# EasyEDA Pro project ProPrj_super_cap_ctrl_v1.0_2025-02-24.epro, board 功率板PCB
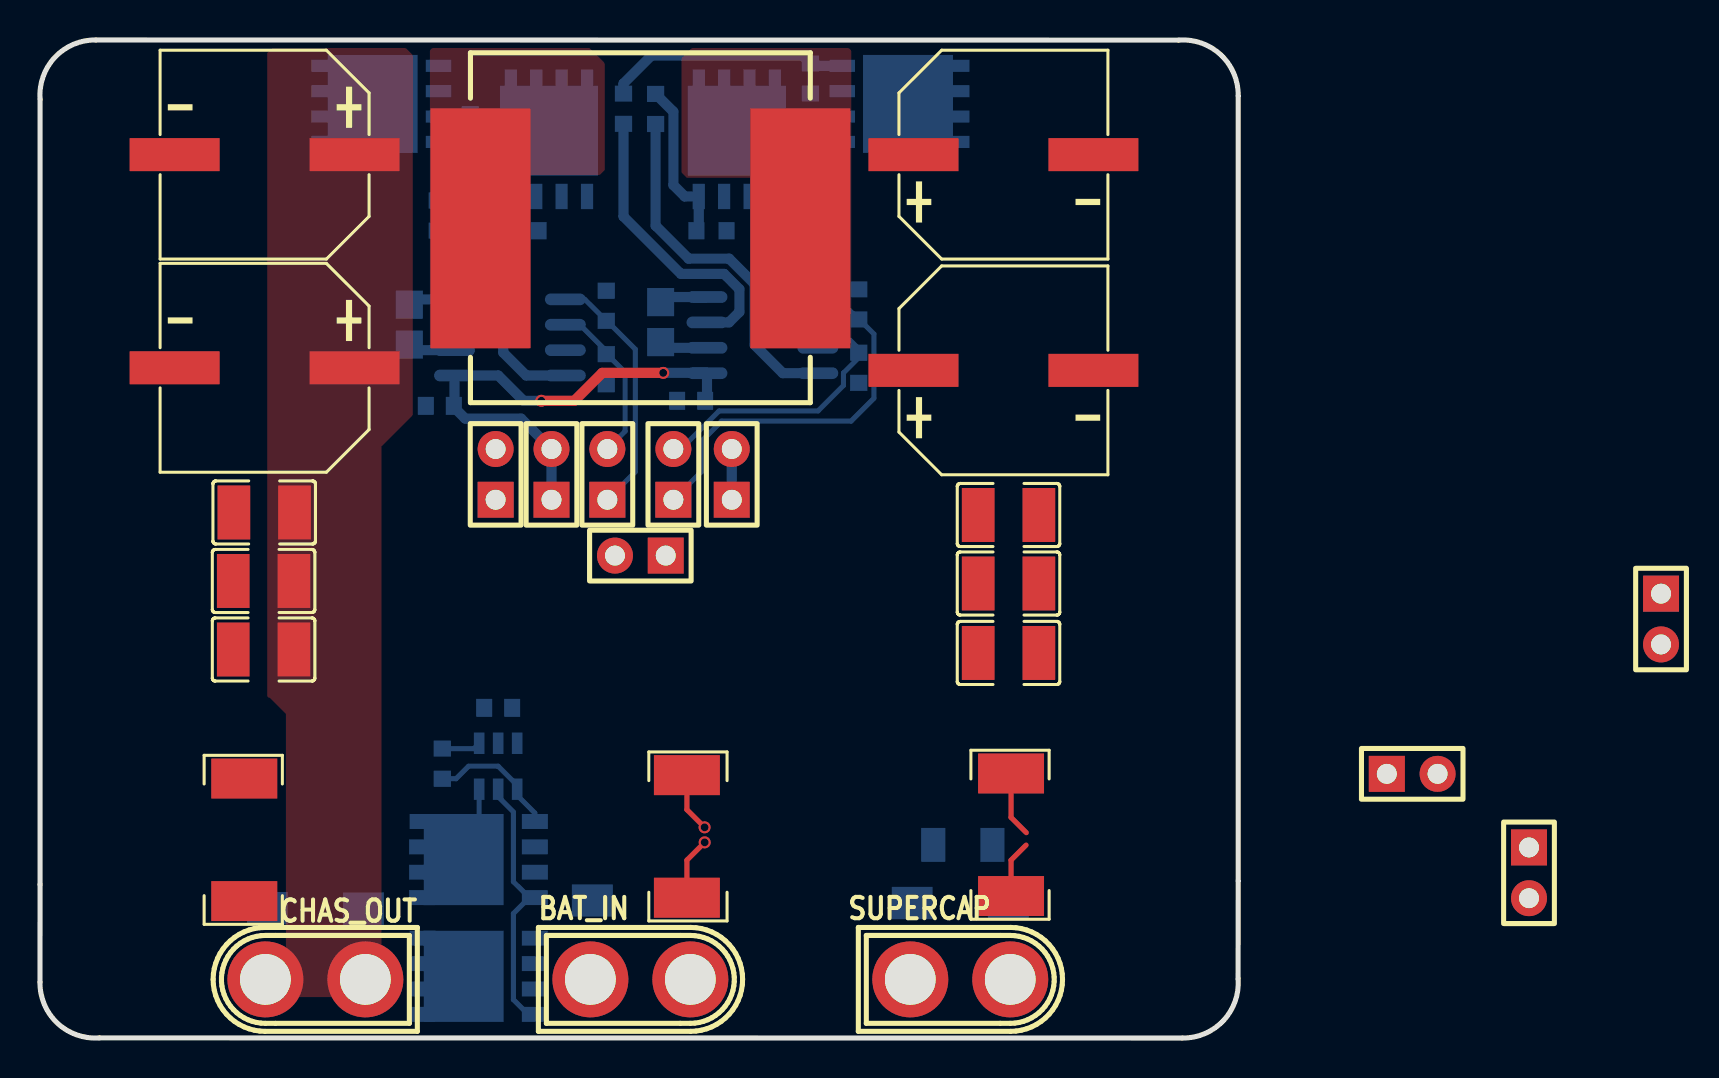
[diagram p10: board, top side]
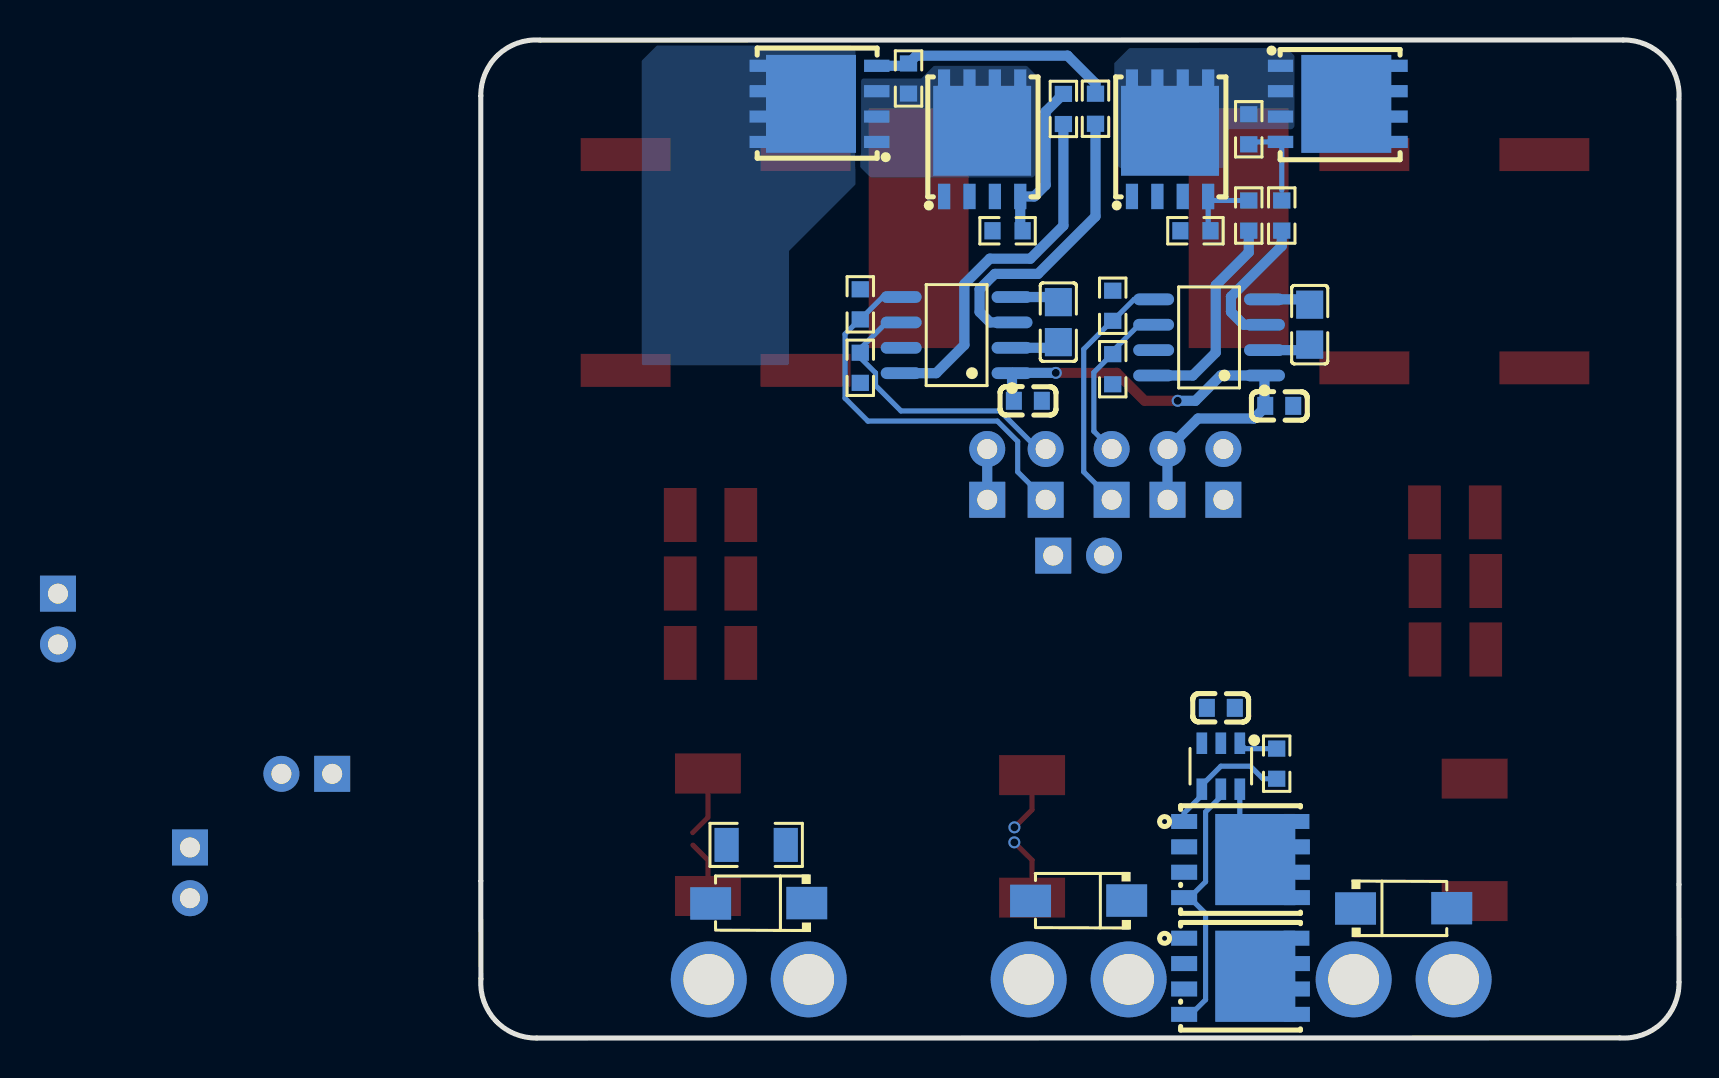
[diagram p11: board, bottom side, seen from below]

Outline 59.94 x 49.95 mm; copper layers: Top Layer, Bottom Layer. Coordinates in mm from the lower left corner of the outline.
Outline path: 0,7.68 0,2.79 arc(0.87,0.75) 2.96,0.01 57.14,0 arc(59.19,0.87) 59.93,2.96 59.94,7.87 59.94,47.15 arc(59.07,49.2) 56.97,49.94 2.79,49.95 arc(0.75,49.08) 0.01,46.98 0,7.68
Stack: Top Layer 0.035mm / Dielectric1 1.51mm FR4 er 4.5 / Bottom Layer 0.035mm

## Design rules (mm)
net HO_1: DP2
net LO_1: DP2
net GND: DP1
net HO_2: DP3
net LO_2: DP3
net VCHASSIS-: DP1
template: 自定义配置
spacing copperThickness1oz (default): track to track 0.102, other pairs 0.076 to 0.3
spacing copperThickness2oz: track to track 0.203, other pairs 0.152 to 0.3
track width copperThickness1oz (default): min 0.127, default 0.254, max 2.54
track width copperThickness2oz: min 0.203, default 0.254, max 2.54
differential pair differentialPair (default): width min 0.127, default 0.254, max 2.54; gap min 0.152, default 0.152
via viaSize (default): diameter min 0.399, default 0.599, max 10; hole min 0.249, default 0.399, max 6.299

## Placement (name value [footprint] x y rotation side)
C1  10uF  [C0603]  20 31.64 0 bottom
C2  1uF  [C0805]  18.47 35.7 270 bottom
C3  150uF  [CAP-SMD_BD10.0-L10.3-W10.3-LS11.3-FD]  11.23 33.54 180 top
C4  150uF  [CAP-SMD_BD10.0-L10.3-W10.3-LS11.3-FD]  11.23 44.21 180 top
C7  47uF  [C1210]  11.21 26.3 0 top
C8  47uF  [C1210]  11.18 22.87 0 top
C9  47uF  [C1210]  11.18 19.44 0 top
C10  150uF  [CAP-SMD_BD10.0-L10.3-W10.3-LS11.3-FD]  48.19 44.21 0 top
C11  150uF  [CAP-SMD_BD10.0-L10.3-W10.3-LS11.3-FD]  48.19 33.41 0 top
C12  47uF  [C1210]  48.45 26.18 180 top
C13  47uF  [C1210]  48.45 22.75 180 top
C14  47uF  [C1210]  48.45 19.27 180 top
C15  10uF  [C0603]  32.57 31.89 0 bottom
C16  1uF  [C0805]  31.05 35.83 270 bottom
C195  100nF  [C0603]  22.92 16.52 180 bottom
CN5  XT30U-M  [CONN-TH_XT30U-M]  13.77 2.93 180 top
CN6  XT30U-M  [CONN-TH_XT30U-M]  30.03 2.93 0 top
CN7  XT30U-M  [CONN-TH_XT30U-M]  46.03 2.93 0 top
D4  SMAJ75A  [SMA_L4.3-W2.6-LS5.0-RD]  46.03 6.74 0 bottom
D5  SMAJ75A  [SMA_L4.3-W2.6-LS5.0-RD]  13.77 6.49 180 bottom
D6  SMAJ75A  [SMA_L4.3-W2.6-LS5.0-RD]  30.03 6.87 0 bottom
H7  -  [HDR-TH_2P-P2.54-V-M-1]  28.38 28.21 90 top
H8  -  [HDR-TH_2P-P2.54-V-M-1]  31.68 28.21 90 top
H9  -  [HDR-TH_2P-P2.54-V-M-1]  34.6 28.21 90 top
H10  -  [HDR-TH_2P-P2.54-V-M-1]  22.79 28.21 90 top
H11  -  [HDR-TH_2P-P2.54-V-M-1]  25.59 28.21 90 top
H12  -  [HDR-TH_2P-P2.54-V-M-1]  30.03 24.14 180 top
H13  -  [HDR-TH_2P-P2.54-V-M-1]  81.08 20.97 270 top
H14  -  [HDR-TH_2P-P2.54-V-M-1]  68.64 13.22 0 top
H15  -  [HDR-TH_2P-P2.54-V-M-1]  74.48 8.27 270 top
L1  22uH  [IND-SMD_L17.5-W17.0_YXMAC1770]  30.03 40.53 0 top
Q7  BSC030N08NS5  [PG-TDSON-8_L5.0-W6.0-P1.27-BL-EP]  21.93 3.09 270 bottom
Q8  BSC030N08NS5  [PG-TDSON-8_L5.0-W6.0-P1.27-BL-EP]  21.93 8.93 270 bottom
Q11  BSC070N10NS5-HXY  [PDFN-8_L6.0-W5.0-P1.27-BL-A]  17.08 46.75 270 bottom
Q12  BSC070N10NS5-HXY  [PDFN-8_L6.0-W5.0-P1.27-BL-A]  42.98 46.75 90 bottom
Q13  BSC070N10NS5-HXY  [PDFN-8_L6.0-W5.0-P1.27-BL-A]  25.46 44.97 180 bottom
Q14  BSC070N10NS5-HXY  [PDFN-8_L6.0-W5.0-P1.27-BL-A]  34.86 44.97 180 bottom
R1  10K  [R0603]  21.52 45.48 270 bottom
R2  4.7R  [R0603]  19.87 41.16 270 bottom
R3  10K  [R0603]  24.19 40.4 180 bottom
R4  4.7R  [R0603]  21.52 41.16 270 bottom
R5  10K  [R0603]  38.54 48.02 90 bottom
R6  4.7R  [R0603]  29.19 46.51 270 bottom
R7  10K  [R0603]  33.59 40.4 180 bottom
R8  4.7R  [R0603]  30.79 46.5 270 bottom
R9  10K  [R0603]  28.33 33.47 90 bottom
R10  10K  [R0603]  28.33 36.65 270 bottom
R11  10K  [R0603]  40.95 33.54 90 bottom
R12  10K  [R0603]  40.95 36.72 270 bottom
R151  10mΩ  [RES-SMD_L6.4-W3.2-R2512]  48.57 10.17 90 top
R152  20K  [R1206]  46.16 9.67 180 bottom
R153  10mΩ  [RES-SMD_L6.4-W3.2-R2512]  10.22 9.92 90 top
R154  47R  [R0603]  20.12 13.73 270 bottom
R155  10mΩ  [RES-SMD_L6.4-W3.2-R2512]  32.36 10.09 270 top
U2  UCC27211D  [SOIC-8_L4.9-W3.9-P1.27-LS6.0-BL]  23.51 35.06 90 bottom
U3  UCC27211D  [SOIC-8_L4.9-W3.9-P1.27-LS6.0-BL]  36.14 35.18 90 bottom
U30  LM5050Q0MK-1/NOPB  [SOT-23-6_L2.9-W1.6-P0.95-LS2.8-BL]  22.92 13.6 0 bottom

## Footprints (pads in the part's own frame, mm; a bottom-side part is the same pattern mirrored in y, then rotated)
C0603
  rect 0.8x0.9 smd: 1(-0.7,0) 2(0.7,0)
C0805
  rect 1.41x1.35 smd: 1(-1,0) 2(1,0)
C1210
  rect 1.635x2.7 smd: 1(-1.518,0) 2(1.518,0)
CAP-SMD_BD10.0-L10.3-W10.3-LS11.3-FD
  rect 4.5x1.65 smd: 1(-4.5,0) 2(4.5,0)
CONN-TH_XT30U-M
  round 3.8 hole 2.54: 1(-2.5,0) 2(2.5,0)
HDR-TH_2P-P2.54-V-M-1
  rect 1.8x1.8 hole 1: 1(-1.27,0)
  round 1.8 hole 1: 2(1.27,0)
IND-SMD_L17.5-W17.0_YXMAC1770
  rect 5x12 smd: 1(-8,0) 2(8,0)
PDFN-8_L6.0-W5.0-P1.27-BL-A
  rect 0.61x1.27 smd: 1(-1.905,-2.856) 2(-0.635,-2.856) 3(0.635,-2.856) 4(1.905,-2.856)
  rect 0.61x1.3 smd: 5(1.905,2.856) 6(0.635,2.856) 7(-0.635,2.856) 8(-1.905,2.856)
  rect 4.9x4.5 smd: 8(0,0.433)
PG-TDSON-8_L5.0-W6.0-P1.27-BL-EP
  rect 0.75x1.3 smd: 1(-1.905,-2.82) 2(-0.635,-2.82) 3(0.635,-2.82) 4(1.905,-2.82) 5(1.905,2.82) 6(0.635,2.82) 7(-0.635,2.82) 8(-1.905,2.794)
  rect 4.56x4 smd: 8(0,0.737)
R0603
  rect 0.806x0.864 smd: 1(-0.753,0) 2(0.753,0)
R1206
  rect 1.208x1.701 smd: 1(-1.479,0) 2(1.479,0)
RES-SMD_L6.4-W3.2-R2512
  rect 2x3.3 smd: 1(-3.067,0) 2(3.067,0)
SMA_L4.3-W2.6-LS5.0-RD
  rect 2.046x1.62 smd: 1(-2.404,-0.009) 2(2.404,0.009)
SOIC-8_L4.9-W3.9-P1.27-LS6.0-BL
  oval 0.588x2.045 smd: 1(-1.905,-2.772) 2(-0.635,-2.772) 3(0.635,-2.772) 4(1.905,-2.772) 5(1.905,2.772) 6(0.635,2.772) 7(-0.635,2.772) 8(-1.905,2.772)
SOT-23-6_L2.9-W1.6-P0.95-LS2.8-BL
  rect 0.532x1.072 smd: 1(-0.95,-1.149) 2(0,-1.149) 3(0.95,-1.149) 4(0.95,1.149) 5(0,1.149) 6(-0.95,1.149)

## Nets
As in the schematic.

## Via types
v1: diameter 0.6, hole 0.399, Top Layer to Bottom Layer, 4 vias

## Routing (per net, layer and track width the routed paths; a pad name or vN(x,y) marks a point on that pad's centre or on a via; arc(x,y) is an arc through that point)
GND: length 6.1
  Top Layer w0.254: v1(33.24,10.54) 32.36,11.43 R155.1 ; 48.57,13.11 48.57,11.04 49.33,10.28
VBAT+: length 6.6
  Bottom Layer w0.254: R154.2 20.81,12.98 21.44,13.6 22.92,13.6 23.87,12.65 U30.4 23.87,12.14 24.75,11.26 Q8.1
VBAT-: length 3.1
  Top Layer w0.254: R155.2 32.36,8.9 v1(33.25,9.79)
VCC_5V: length 2.5
  Bottom Layer w0.508: H9.2 H9.1
VCC_9.5V: length 25.3
  Top Layer w0.508: v1(25.08,31.89) 26.73,31.89 28.13,33.29 v1(31.17,33.29)
  Bottom Layer w0.508: C15.2 33.27,31.79 33.29,31.77 33.36,31.84 U3.1 33.35,33.29 v1(31.17,33.29) ; H11.1 H11.2 24.06,31 21.27,31 20.73,31.53 U2.1 22.92,33.16 24.19,31.89 v1(25.08,31.89)
HO_1: length 7.1
  Bottom Layer w0.508: U2.3 21.77,35.7 22.41,36.34 22.41,37.1 19.87,39.64 R2.2
HO_2: length 14.9
  Bottom Layer w0.508: U3.3 34.46,35.81 34.98,36.34 34.98,37.48 34.22,38.24 32.06,38.24 29.19,41.12 R6.2
HRTIM1_CHA1: length 12.6
  Bottom Layer w0.254: H7.1 29.78,28.33 29.78,34.47 28.35,35.89 R10.2 27.25,36.97 U2.5
HRTIM1_CHA2: length 8.3
  Bottom Layer w0.254: U2.6 27.01,35.7 28.33,34.38 R9.2 28.35,34.23 29.27,33.31 29.27,30.37 H7.2
HRTIM1_CHD1: length 19.8
  Bottom Layer w0.254: H8.1 33.08,28.33 33.08,29.86 34.09,30.87 40.57,30.87 41.71,32.02 41.71,35.23 40.98,35.96 R12.2 39.83,37.08 U3.5
HRTIM1_CHD2: length 14.6
  Bottom Layer w0.254: U3.6 39.64,35.81 40.95,34.5 R11.2 40.95,34.05 40.19,33.29 40.19,32.66 38.92,31.38 33.97,31.38 32.06,29.48 H8.2
LO_1: length 10.4
  Bottom Layer w0.508: R4.2 21.52,39.32 23.17,37.67 23.17,34.3 24.32,33.16 U2.8
LO_2: length 18
  Bottom Layer w0.508: U3.8 37.16,33.27 35.75,34.68 35.75,37.73 34.48,39 32.44,39 30.79,40.65 R8.2
SW1: length 2.4
  Bottom Layer w0.508: U2.4 18.74,36.97 C2.1
SW2: length 2.4
  Bottom Layer w0.508: C16.1 31.3,37.08 U3.4
VCAP-: length 2.9
  Top Layer w0.254: 49.32,9.65 48.57,8.9 R151.1
VCHASSIS+: length 3.8
  Bottom Layer w0.254: Q8.8 21.97,9.71 U30.6
$1N418: length 2.4
  Bottom Layer w0.508: U2.2 18.75,34.43 C2.2
$1N971: length 4.1
  Bottom Layer w0.254: 19.87,42.42 19.87,44.78 Q11.4 21.4,44.84 R1.2
$1N1037: length 3.9
  Bottom Layer w0.254: R3.2 23.55,40.52 Q13.4 23.35,41.92 R4.1
$1N1093: length 12.3
  Bottom Layer w0.508: Q12.4 38.54,48.65 R5.2 38.15,49.16 30.58,49.16 29.19,47.77 R6.1
$1N1202: length 8.2
  Bottom Layer w0.508: R8.1 31.68,46.36 31.68,42.69 32.25,42.12 Q14.4 32.95,40.52 R7.2
$1N4475: length 2.4
  Bottom Layer w0.508: C16.2 31.33,34.54 U3.2
$1N6839: length 13.2
  Bottom Layer w0.254: 24.75,1.19 24.41,1.19 23.68,1.92 23.68,6.23 24.48,7.03 ; U30.5 22.92,12.08 23.68,11.32 23.68,7.82 24.48,7.03 ; 24.48,7.03 Q8.4
$1N6847: length 2.3
  Bottom Layer w0.254: 21.97,16.27 C195.2 ; R154.1 21.7,14.48 U30.1

## Copper pours and planes (outline as drawn; the poured copper is in the pictures)
SW1 on Top Layer: 19.5,34.5 24.56,34.5 24.56,43.18 24.57,43.19 28,43.19 28.25,43.45 28.25,48.78 27.49,49.54 19.62,49.54 19.5,49.43
SW1 on Bottom Layer: 19.24,49.16 19.62,49.54 27.49,49.54 28.25,48.78 28.25,43.81 27.98,43.55 22.82,43.55 22.59,43.78 22.59,45.4 22.5,45.48 19.36,45.48 19.24,45.61
SW2 on Top Layer: 40.58,34.49 35.53,34.49 35.53,43.05 32.35,43.05 32.08,43.32 32.08,49.03 32.59,49.54 40.47,49.54 40.58,49.43
SW2 on Bottom Layer: 32.22,48.25 32.62,48.65 37.27,48.65 37.9,48.02 40.83,48.02 40.95,47.89 40.95,43.57 40.44,43.07 32.32,43.07 32.22,43.17
VCAP+ on Bottom Layer: 51.89,48.91 51.12,49.67 41.4,49.67 41.2,49.47 41.2,42.71 44.52,39.38 44.52,33.67 51.89,33.67
VCHASSIS+ on Top Layer: 11.62,49.54 18.29,49.54 18.65,49.19 18.65,31.17 17.08,29.6 17.08,2.43 16.7,2.05 12.6,2.05 12.3,2.35 12.3,16.22 11.49,17.03 11.36,17.03 11.36,49.29

## Text on the board
Top Silkscreen Layer: SUPERCAP | CHAS_OUT | BAT_IN
